# EAGLE schematic bedofnails (EAGLE 6.5.0)
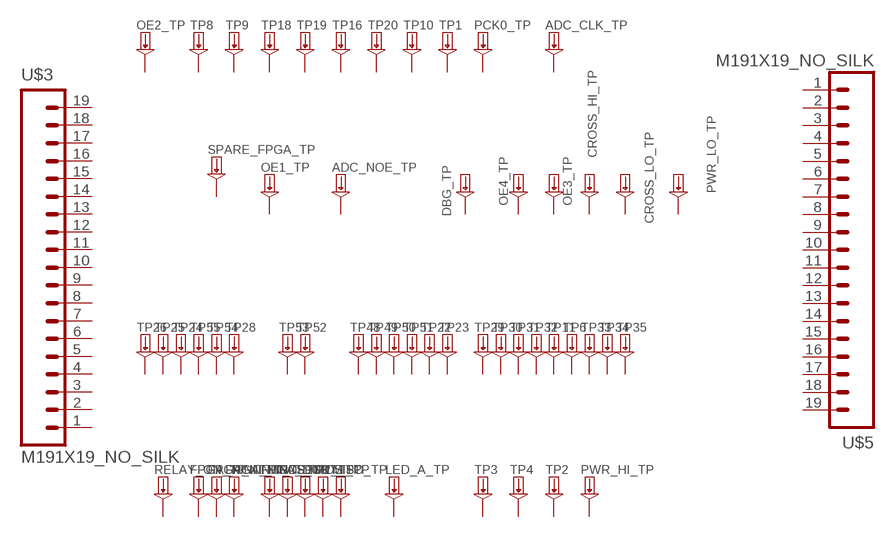
[diagram p0: schematic, sheet 1]

## Parts
ADC_CLK_TP  TESTPAD  [SMD-TESTPOINT]
ADC_NOE_TP  TESTPAD  [SMD-TESTPOINT]
CROSS_HI_TP  TESTPAD  [SMD-TESTPOINT]
CROSS_LO_TP  TESTPAD  [SMD-TESTPOINT]
DBG_TP  TESTPAD  [SMD-TESTPOINT]
FPGA_DOUT_TP  TESTPAD  [SMD-TESTPOINT]
FPGA_NINIT_TP  TESTPAD  [SMD-TESTPOINT]
FPGA_NINIT_TP1  TESTPAD  [SMD-TESTPOINT]
FPGA_NINIT_TP2  TESTPAD  [SMD-TESTPOINT]
LED_A_TP  TESTPAD  [SMD-TESTPOINT]
MISO_TP  TESTPAD  [SMD-TESTPOINT]
MOSI_TP  TESTPAD  [SMD-TESTPOINT]
NCS_TP  TESTPAD  [SMD-TESTPOINT]
OE1_TP  TESTPAD  [SMD-TESTPOINT]
OE2_TP  TESTPAD  [SMD-TESTPOINT]
OE3_TP  TESTPAD  [SMD-TESTPOINT]
OE4_TP  TESTPAD  [SMD-TESTPOINT]
PCK0_TP  TESTPAD  [SMD-TESTPOINT]
PWR_HI_TP  TESTPAD  [SMD-TESTPOINT]
PWR_LO_TP  TESTPAD  [SMD-TESTPOINT]
RELAY_ON_TP  TESTPAD  [SMD-TESTPOINT]
SPARE_FPGA_TP  TESTPAD  [SMD-TESTPOINT]
SPCK_TP  TESTPAD  [SMD-TESTPOINT]
TP1  TESTPAD  [SMD-TESTPOINT]
TP2  TESTPADKEYSTONE-SMD  [KEYSTONE-SMD-TESTPOINT-5015]
TP3  TESTPADKEYSTONE-SMD  [KEYSTONE-SMD-TESTPOINT-5015]
TP4  TESTPADKEYSTONE-SMD  [KEYSTONE-SMD-TESTPOINT-5015]
TP6  TESTPAD  [SMD-TESTPOINT]
TP8  TESTPAD0.7MM-ROUND-DRILLED  [TESTPAD-PTH-0.7MM]
TP9  TESTPADKEYSTONE-SMD  --MERGED_TESTPADKEYSTONE-SMD  [--MERGED_KEYSTONE-SMD-TESTPOINT-5015]
TP10  TESTPADKEYSTONE-SMD  --MERGED_TESTPADKEYSTONE-SMD  [--MERGED_KEYSTONE-SMD-TESTPOINT-5015]
TP11  TESTPAD  [SMD-TESTPOINT]
TP16  TESTPAD  [SMD-TESTPOINT]
TP18  TESTPAD  [SMD-TESTPOINT]
TP19  TESTPAD  [SMD-TESTPOINT]
TP20  TESTPAD  [SMD-TESTPOINT]
TP22  TESTPAD  [SMD-TESTPOINT]
TP23  TESTPAD  [SMD-TESTPOINT]
TP24  TESTPAD  [SMD-TESTPOINT]
TP25  TESTPAD  [SMD-TESTPOINT]
TP26  TESTPAD  [SMD-TESTPOINT]
TP28  TESTPAD  [SMD-TESTPOINT]
TP29  TESTPAD  [SMD-TESTPOINT]
TP30  TESTPAD  [SMD-TESTPOINT]
TP31  TESTPAD  [SMD-TESTPOINT]
TP32  TESTPAD  [SMD-TESTPOINT]
TP33  TESTPAD  [SMD-TESTPOINT]
TP34  TESTPAD  [SMD-TESTPOINT]
TP35  TESTPAD  [SMD-TESTPOINT]
TP48  TESTPAD  [SMD-TESTPOINT]
TP49  TESTPAD  [SMD-TESTPOINT]
TP50  TESTPAD  [SMD-TESTPOINT]
TP51  TESTPAD  [SMD-TESTPOINT]
TP52  TESTPAD  [SMD-TESTPOINT]
TP53  TESTPAD  [SMD-TESTPOINT]
TP54  TESTPAD  [SMD-TESTPOINT]
TP55  TESTPAD  [SMD-TESTPOINT]
U$3  M191X19_NO_SILK  [1X19_NO_SILK]
U$5  M191X19_NO_SILK  [1X19_NO_SILK]
Unconnected: ADC_CLK_TP.1 ADC_NOE_TP.1 CROSS_HI_TP.1 CROSS_LO_TP.1 DBG_TP.1 FPGA_DOUT_TP.1 FPGA_NINIT_TP1.1 FPGA_NINIT_TP2.1 FPGA_NINIT_TP.1 LED_A_TP.1 MISO_TP.1 MOSI_TP.1 NCS_TP.1 OE1_TP.1 OE2_TP.1 OE3_TP.1 OE4_TP.1 PCK0_TP.1 PWR_HI_TP.1 PWR_LO_TP.1 RELAY_ON_TP.1 SPARE_FPGA_TP.1 SPCK_TP.1 TP1.1 TP2.1 TP3.1 TP4.1 TP6.1 TP8.1 TP9.1 TP10.1 TP11.1 TP16.1 TP18.1 TP19.1 TP20.1 TP22.1 TP23.1 TP24.1 TP25.1 TP26.1 TP28.1 TP29.1 TP30.1 TP31.1 TP32.1 TP33.1 TP34.1 TP35.1 TP48.1 TP49.1 TP50.1 TP51.1 TP52.1 TP53.1 TP54.1 TP55.1 U$3.1 U$3.2 U$3.3 U$3.4 U$3.5 U$3.6 U$3.7 U$3.8 U$3.9 U$3.10 U$3.11 U$3.12 U$3.13 U$3.14 U$3.15 U$3.16 U$3.17 U$3.18 U$3.19 U$5.1 U$5.2 U$5.3 U$5.4 U$5.5 U$5.6 U$5.7 U$5.8 U$5.9 U$5.10 U$5.11 U$5.12 U$5.13 U$5.14 U$5.15 U$5.16 U$5.17 U$5.18 U$5.19

## Library data of the parts
ADC_CLK_TP ADC_NOE_TP CROSS_HI_TP CROSS_LO_TP DBG_TP OE1_TP OE2_TP OE3_TP OE4_TP PCK0_TP PWR_HI_TP PWR_LO_TP SPARE_FPGA_TP TP1 = bedofnails:TESTPAD; OC_NEWARK: unknown; PARTNO: *
FPGA_DOUT_TP FPGA_NINIT_TP FPGA_NINIT_TP1 FPGA_NINIT_TP2 LED_A_TP MISO_TP MOSI_TP NCS_TP RELAY_ON_TP SPCK_TP TP6 TP11 TP16 TP18-TP20 TP22-TP26 TP28-TP35 TP48-TP55 = bedofnails:TESTPAD
TP2-TP4 = STM32-PROX:TESTPAD; OC_NEWARK: unknown; PARTNO: *
TP8 = STM32-PROX:TESTPAD; MPN: NONE; OC_NEWARK: unknown; PARTNO: NONE
TP9 TP10 = STM32-PROX:--MERGED_TESTPAD; MPN: NONE; OC_NEWARK: unknown; PARTNO: NONE
U$3 U$5 = SparkFun-Connectors:M19: 1x19 .1" header

## Net classes
0 default: width 0.203 mm
1 adc: width 0.203 mm
2 power: width 0.279 mm, drill 0.254 mm